# Altium schematic sheet Cell_121_sheet_4.SchDoc
size 209 x 297 mm; DocumentNumber: Фг3.089.121 Э3; SheetNumber: 4; SheetTotal: 4
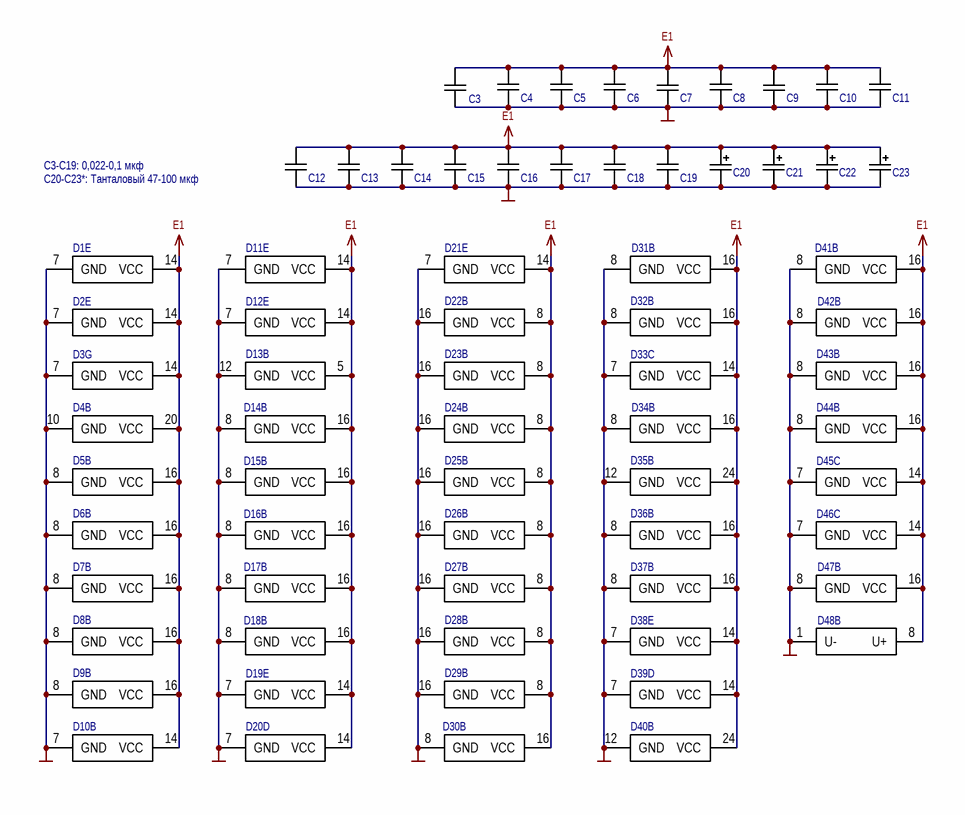
[diagram p0: Cell_121_sheet_4.SchDoc]

## Parts
C3  0,1 мкф  [C5]  (value not drawn)
C4  0,1 мкф  [C5]  (value not drawn)
C5  0,1 мкф  [C5]  (value not drawn)
C6  0,1 мкф  [C5]  (value not drawn)
C7  0,1 мкф  [C5]  (value not drawn)
C8  0,1 мкф  [C5]  (value not drawn)
C9  0,1 мкф  [C5]  (value not drawn)
C10  0,1 мкф  [C5]  (value not drawn)
C11  0,1 мкф  [C5]  (value not drawn)
C12  0,1 мкф  [C5]  (value not drawn)
C13  0,1 мкф  [C5]  (value not drawn)
C14  0,1 мкф  [C5]  (value not drawn)
C15  0,1 мкф  [C5]  (value not drawn)
C16  0,1 мкф  [C5]  (value not drawn)
C17  0,1 мкф  [C5]  (value not drawn)
C18  0,1 мкф  [C5]  (value not drawn)
C19  0,1 мкф  [C5]  (value not drawn)
C20  47 мкф  [SMD D]  (value not drawn)
C21  47 мкф  [SMD D]  (value not drawn)
C22  47 мкф  [SMD D]  (value not drawn)
C23  47 мкф  [SMD D]  (value not drawn)
D1  К555ЛИ1  [201.14]  (value not drawn)  (part E of 5)
D2  К555ЛЕ1  [201.14]  (value not drawn)  (part E of 5)
D3  К555ЛН1  [201.14]  (value not drawn)  (part G of 7)
D4  К555ИР22  [201.20]  (value not drawn)  (part B of 2)
D5  К555ИЕ10  [201.16]  (value not drawn)  (part B of 2)
D6  К555ИЕ10  [201.16]  (value not drawn)  (part B of 2)
D7  К555ИЕ10  [201.16]  (value not drawn)  (part B of 2)
D8  К555ИЕ10  [201.16]  (value not drawn)  (part B of 2)
D9  К555ИР11А  [201.16]  (value not drawn)  (part B of 2)
D10  К555ИР16  [201.14]  (value not drawn)  (part B of 2)
D11  К555ЛА3  [201.14]  (value not drawn)  (part E of 5)
D12  К555ЛП5  [201.14]  (value not drawn)  (part E of 5)
D13  К155ИМ3  [201.16]  (value not drawn)  (part B of 2)
D14  К555КП11  [201.16]  (value not drawn)  (part B of 2)
D15  К555КП12  [201.16]  (value not drawn)  (part B of 2)
D16  К555КП12  [201.16]  (value not drawn)  (part B of 2)
D17  К555КП12  [201.16]  (value not drawn)  (part B of 2)
D18  К555КП12  [201.16]  (value not drawn)  (part B of 2)
D19  К555ЛЕ1  [201.14]  (value not drawn)  (part E of 5)
D20  К555ЛИ3  [201.14]  (value not drawn)  (part D of 4)
D21  К555ЛЕ1  [201.14]  (value not drawn)  (part E of 5)
D22  К565РУ5  [201.16]  (value not drawn)  (part B of 2)
D23  К565РУ5  [201.16]  (value not drawn)  (part B of 2)
D24  К565РУ5  [201.16]  (value not drawn)  (part B of 2)
D25  К565РУ5  [201.16]  (value not drawn)  (part B of 2)
D26  К565РУ5  [201.16]  (value not drawn)  (part B of 2)
D27  К565РУ5  [201.16]  (value not drawn)  (part B of 2)
D28  К565РУ5  [201.16]  (value not drawn)  (part B of 2)
D29  К565РУ5  [201.16]  (value not drawn)  (part B of 2)
D30  К555ТМ9  [201.16]  (value not drawn)  (part B of 2)
D31  К555ТМ9  [201.16]  (value not drawn)  (part B of 2)
D32  К555ИР11А  [201.16]  (value not drawn)  (part B of 2)
D33  К555ТМ2  [201.14]  (value not drawn)  (part C of 3)
D34  К555ИД4  [201.16]  (value not drawn)  (part B of 2)
D35  К573РФ2  [2120.24 socket]  (value not drawn)  (part B of 2)
D36  К555ИР11А  [201.16]  (value not drawn)  (part B of 2)
D37  К555ИР11А  [201.16]  (value not drawn)  (part B of 2)
D38  К555ЛИ1  [201.14]  (value not drawn)  (part E of 5)
D39  К555ЛИ3  [201.14]  (value not drawn)  (part D of 4)
D40  К155ИР13  [2120.24]  (value not drawn)  (part B of 2)
D41  К555КП12  [201.16]  (value not drawn)  (part B of 2)
D42  К555КП12  [201.16]  (value not drawn)  (part B of 2)
D43  К555ИД7  [201.16]  (value not drawn)  (part B of 2)
D44  К555ИР11А  [201.16]  (value not drawn)  (part B of 2)
D45  К555ТМ2  [201.14]  (value not drawn)  (part C of 3)
D46  К555ТМ2  [201.14]  (value not drawn)  (part C of 3)
D47  К555КП11  [201.16]  (value not drawn)  (part B of 2)
D48  КР1006ВИ1  [2101.8]  (value not drawn)  (part B of 2)

## Nets
E1: C3.1 C4.2 C5.2 C6.2 C7.1 C8.2 C9.1 C10.2 C11.2 C12.2 C13.2 C14.2 C15.2 C16.2 C17.2 C18.2 C19.2 C20.1 C21.1 C22.1 C23.1 D1.14(VCC) D2.14(VCC) D3.14(VCC) D4.20(VCC) D5.16(VCC) D6.16(VCC) D7.16(VCC) D8.16(VCC) D9.16(VCC) D10.14(VCC) D11.14(VCC) D12.14(VCC) D13.5(VCC) D14.16(VCC) D15.16(VCC) D16.16(VCC) D17.16(VCC) D18.16(VCC) D19.14(VCC) D20.14(VCC) D21.14(VCC) D22.8(VCC) D23.8(VCC) D24.8(VCC) D25.8(VCC) D26.8(VCC) D27.8(VCC) D28.8(VCC) D29.8(VCC) D30.16(VCC) D31.16(VCC) D32.16(VCC) D33.14(VCC) D34.16(VCC) D35.24(VCC) D36.16(VCC) D37.16(VCC) D38.14(VCC) D39.14(VCC) D40.24(VCC) D41.16(VCC) D42.16(VCC) D43.16(VCC) D44.16(VCC) D45.14(VCC) D46.14(VCC) D47.16(VCC) D48.8(U+)
GND: C3.2 C4.1 C5.1 C6.1 C7.2 C8.1 C9.2 C10.1 C11.1 C12.1 C13.1 C14.1 C15.1 C16.1 C17.1 C18.1 C19.1 C20.2 C21.2 C22.2 C23.2 D1.7(GND) D2.7(GND) D3.7(GND) D4.10(GND) D5.8(GND) D6.8(GND) D7.8(GND) D8.8(GND) D9.8(GND) D10.7(GND) D11.7(GND) D12.7(GND) D13.12(GND) D14.8(GND) D15.8(GND) D16.8(GND) D17.8(GND) D18.8(GND) D19.7(GND) D20.7(GND) D21.7(GND) D22.16(GND) D23.16(GND) D24.16(GND) D25.16(GND) D26.16(GND) D27.16(GND) D28.16(GND) D29.16(GND) D30.8(GND) D31.8(GND) D32.8(GND) D33.7(GND) D34.8(GND) D35.12(GND) D36.8(GND) D37.8(GND) D38.7(GND) D39.7(GND) D40.12(GND) D41.8(GND) D42.8(GND) D43.8(GND) D44.8(GND) D45.7(GND) D46.7(GND) D47.8(GND) D48.1(U-)

## Notes on the sheet
- C3-C19: 0,022-0,1 мкф
- C20-C23*: Танталовый 47-100 мкф
- Перв. примен.
- Справ. №
- Подп. и дата
- Инв. № дубл.
- Взам. инв. №
- Разраб.
- Изм.
- Лист
- № докум.
- Подп.
- Дата
- Лит.
- Масса
- Масштаб
- Пров.
- Т.контр.
- Листов
- Инв. № подл.
- Утв.
- Н.контр.
- 2.106-A4
- Копировал
- Формат А4

## Library data of the parts
C3-C19 = К10-17: Value: 0,1 мкф
C20-C23 = К53-1: К53-14; Value: 47 мкф
D2 D19 D21 = К555ЛЕ1: ManufacturerPartNumber: К555ЛА3
D3 = К555ЛН1: ManufacturerPartNumber: К155ЛН1
D5-D8 = К555ИЕ10: ManufacturerPartNumber: КР531ИЕ17
D9 D32 D36 D37 D44 = К555ИР11А: ManufacturerPartNumber: КР531ИЕ17
D10 = К555ИР16: ManufacturerPartNumber: КР531ИЕ17
D12 = К555ЛП5: ManufacturerPartNumber: К155ЛП5
D13 = К155ИМ3: ManufacturerPartNumber: SN74ALS138
D15-D18 D41 D42 = К555КП12: ManufacturerPartNumber: К155КП2
D20 D39 = К555ЛИ3: ManufacturerPartNumber: К555ЛА3
D30 D31 = К555ТМ9: ManufacturerPartNumber: SN74ALS174
D43 = К555ИД7: ManufacturerPartNumber: SN74ALS138
D48 = КР1006ВИ1: ManufacturerPartNumber: К555ИД4
D1 D38 = К555ЛИ1: ManufacturerPartNumber: К555ЛИ1
D11 = К555ЛА3: ManufacturerPartNumber: К555ЛА3
D14 D47 = К555КП11: ManufacturerPartNumber: К555КП11
D22-D29 = К565РУ5: ManufacturerPartNumber: К565РУ5
D34 = К555ИД4: ManufacturerPartNumber: К555ИД4